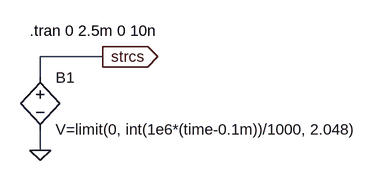
[diagram p0: schematic staircase1.asc]
staircase1.asc, the LTspice schematic file:
Version 4
SHEET 1 880 680
WIRE 160 64 64 64
WIRE 64 96 64 64
WIRE 64 208 64 176
FLAG 64 208 0
FLAG 160 64 strcs
IOPIN 160 64 Out
SYMBOL bv 64 80 R0
SYMATTR InstName B1
SYMATTR Value V=limit(0, int(1e6*(time-0.1m))/1000, 2.048)
TEXT 48 24 Left 0 !.tran 0 2.5m 0 10n

The netlist it stands for:
* staircase1.asc
B1 strcs 0 V=limit(0, int(1e6*(time-0.1m))/1000, 2.048)
.tran 0 2.5m 0 10n
.backanno
.end